# Altium project Schematic.PrjPcb
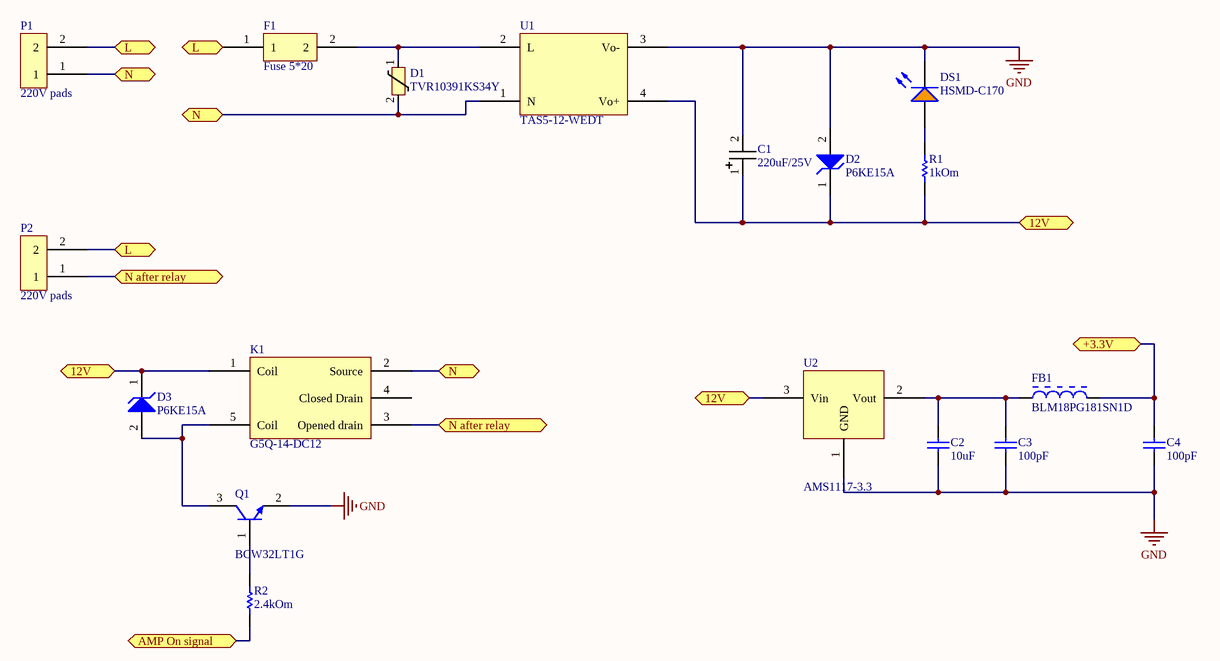
[diagram p0: power.SchDoc]
3 sheets, 62 parts. Net scope: flat (ports and power ports of the same name join across sheets).
Board file: PCB.PcbDoc
Sheets:
  power.SchDoc
  mcu.SchDoc
  ble.SchDoc

## Sheet power.SchDoc
size A4

### Parts
C1  220uF/25V  [Capacitor 7*8]
C2  10uF  [CAPC1608X90X35ML10T15]
C3  100pF  [CAPC1608X90X35ML10T15]
C4  100pF  [CAPC1608X90X35ML10T15]
D1  TVR10391KS34Y  [TVR10391KS34Y]
D2  P6KE15A  [ONSC-SURMETIC40-2-017AA-01]
D3  P6KE15A  [ONSC-SURMETIC40-2-017AA-01]
DS1  HSMD-C170  [AVAG-HSMX-C170_V]
F1  Fuse 5*20  [Fuse 5*20]
FB1  BLM18PG181SN1D  [MURA-BLM18PG_KG-CHIP-2_V2]
K1  G5Q-14-DC12  [G5Q-14-DC12]
P1  220V pads  [220V pads]
P2  220V pads  [220V pads]
Q1  BCW32LT1G  [ONSC-SOT-23-3-318-08_V]
R1  1kOm  [RESC1608X55X30ML20T10]
R2  2.4kOm  [RESC1608X55X30ML20T10]
U1  TAS5-12-WEDT  [TAS5-12-WEDT]
U2  AMS1117-3.3  [AMS1117]

### Ports
12V (bidir), +3.3V (bidir), AMP On signal (bidir), L (bidir), N (bidir), N after relay (bidir)

### Nets
GND: C1.2 C2.1 C3.1 C4.1 D2.2(A) DS1.2(K) Q1.2(E) U1.3(Vo-) U2.1(GND)
NetC1_1: C1.1 D2.1(K) D3.1(K) K1.1(Coil) R1.1 U1.4(Vo+) U2.3(Vin) ; port 12V
NetC2_2: C2.2 C3.2 FB1.1 U2.2(Vout)
NetC4_2: C4.2 FB1.2 ; port +3.3V
NetD1_1: D1.1 F1.2 U1.2(L)
NetD1_2: D1.2 K1.2(Source) P1.1 U1.1(N) ; port N
NetD3_2: D3.2(A) K1.5(Coil) Q1.3(C)
NetDS1_1: DS1.1(A) R1.2
NetF1_1: F1.1 P1.2 P2.2 ; port L
NetK1_3: K1.3(Opened_drain) P2.1 ; port N after relay
NetQ1_1: Q1.1(B) R2.2
NetR2_1: R2.1 ; port AMP On signal

Not connected (* = marked no-connect by the designer): K1 4(Closed_Drain)

### Library data of the parts
C1 = Capacitor 7*8
C2-C4 = CMP-2006-02335-1: Manufacturer: Murata; Part Number: GCM1885C2A101JA16D
D2 D3 = CMP-1061-00710-1: 600 W Peak Power Transient Voltage Suppressor, 2-Pin Surmetic(TM) 40, Pb-Free, Bulk Box; Manufacturer: On Semiconductor; PartNumber: P6KE15AG; PPK Max (W): 600; Direction: Unidirectional; V(BR) Typ (V): 15.05; IR Max (uA): 5; Packing: Bulk Box; ComponentLink2URL: http://www.onsemi.com/pub_link/Collateral/P6KE6.8A-D.PDF; ComponentLink1URL: http://www.onsemi.com/; DatasheetVersion: Rev. 10; ComponentLink2Description: Datasheet; ComponentLink3Description: Package Specification; Mounting Technology: Through Hole; PackageReference: SURMETIC40-2-017AA-01; ComponentLink1Description: Manufacturer URL; ComponentLink3URL: http://www.onsemi.cn/pub_link/Collateral/017AA.PDF; PackageVersion: Rev. O, 09/2005; RoHS: Pb-Free; PackageDescription: 2-Pin, Axial Lead, Diameter 3.49 mm
DS1 = CMP-2000-06421-1: LED Uni-Color Orange, 52 mW, 20 mA, -40 to 85 degC, 2-Pin SMD, RoHS, Tape and Reel; Manufacturer: Avago; Forward Current If Max: 20mA; External Length / Height: 2mm; Luminous Intensity: 8mcd; Lens Shape: Rectangular; Bulb Size: 1.25mmx1.4mm; External Width: 1.25mm; Wavelength Typ: 605nm; Dominant Wavelength: 604nm; PIV Max: 5V; Opto Mounting Orientation: Top; Viewing Angle: 170°; LED Type: Standard; Forward Voltage: 2.2V; SVHC: NoSVHC(19-Dec-2012); No. of Pins: 2; External Depth: 0.8mm; Power Dissipation Pd: 52mW; Storage Temperature Max: 85°C; Package Description: 2-Pin Surface Mount Device, Body 2 x 1.25 mm, Height 0.8 mm; MSL: MSL2A-4weeks; Operating Temperature Range: -30°Cto+85°C; Datasheet URL: http://docs.avagotech.com/docs/AV02-0551EN; Manufacturer URL: http://www.avagotech.com/; Operating Temperature Min: -30°C; Light Area Height: 1.25mm; Mounting Technology: SurfaceMount; Storage Temperature Min: -40°C; LED Mounting: SMD; Peak Wavelength: 605nm; Package / Case: SMD; Peak Forward Current: 20mA; Forward Voltage VF Max: 2.2V; Mounting Type: SMD; LED Colour: Orange; Forward Current If: 20mA; Operating Temperature Max: 85°C; Voltage Vf Typ: 2.2V; Package Reference: HSMX-C170; Datasheet Version: 03/2012; Opto Case Style: SMD; Luminous Intensity Typ: 8mcd
FB1 = CMP-0686-00566-2: Chip Ferrite Bead for Power Lines, 180 Ohm, 1500 mA, -55 to 125 degC, 1.6 x 0.8 x 0.95 mm SMD, Tape and Reel; Manufacturer: Murata; Impedance (at 100 MHz): 180 Ohm +/- 25%; Rated Current: 1500 mA; DC Resistance: 0.09 Ohm Max.; ComponentLink3Description: Package Specification; PackageDescription: 2-Pin Chip, Body 1.6 x 0.8 mm; Mounting Technology: Surface Mount; ComponentLink1Description: Manufacturer URL; Operating Temperature Range: -55 to 125 degC; Packing: Tape and Reel; DatasheetVersion: 08/2013; ComponentLink3URL: http://www.murata.com/products/catalog/pdf/c31e.pdf; ComponentLink2Description: Datasheet; PartNumber: BLM18PG181SN1D; ComponentLink1URL: http://www.murata.com/; ComponentLink2URL: http://www.murata.com/products/catalog/pdf/c31e.pdf; PackageReference: BLM18_H950-2
Q1 = CMP-1048-00823-1: General Purpose Transistor, NPN Silicon, 3-Pin SOT-23, Pb-Free, Tape and Reel; Manufacturer: On Semiconductor; IC Continuous (A): 0.1; PackageReference: SOT-23-3-318-08; Polarity: NPN; Mounting Technology: Surface Mount; ComponentLink2URL: http://www.onsemi.com/pub_link/Collateral/BCW32LT1-D.PDF; RoHS: TRUE; PackageVersion: Rev. AP, 11/2009; Packing: Tape and Reel; ComponentLink3Description: Package Specification; PartNumber: BCW32LT1G; ComponentLink1Description: Manufacturer URL; PackageDescription: 3-Pin Small Outline Transistor, Body 2.92 x 1.3 mm, Pitch 0.95 mm; ComponentLink3URL: http://www.onsemi.cn/pub_link/Collateral/318-08.PDF; ComponentLink1URL: http://www.onsemi.com/; DatasheetVersion: Rev. 2; ComponentLink2Description: Datasheet
R1 R2 = CMP-2000-01555-1: Part Number: RK73H1JTTD5101F; Manufacturer: KOA Speer
D1 = TVR10391KS34Y: ComponentLink1Description: https://lcsc.com/product-detail/Varistors_TKS-TVR10391KS34Y_C2760960.html; ComponentLink1URL: *
F1 = Fuse 5*20: ComponentLink1Description: https://lcsc.com/product-detail/span-style-background-color-ff0-Fuse-span-Holders_Xucheng-Elec-C3130_C3130.html; ComponentLink1URL: *
K1 = G5Q-14-DC12: ComponentLink1Description: https://lcsc.com/product-detail/Relays_Omron-Electronics-G5Q-14-DC12_C225715.html; ComponentLink1URL: *
U1 = TAS5-12-WEDT: ComponentLink1Description: https://lcsc.com/product-detail/Power-Modules_TDPOWER-TAS5-12-WEDT_C2687652.html; ComponentLink1URL: *
U2 = AMS1117-3.3: ComponentLink1Description: New link; ComponentLink1URL: https://lcsc.com/product-detail/Low-Dropout-Regulators-LDO_Slkor-SLKORMICRO-Elec-AMS1117-3-3_C426566.html; ComponentLink2Description: New link; ComponentLink2URL: https://lcsc.com/product-detail/Low-Dropout-Regulators-LDO_PUOLOP-AMS1117-3-3_C351784.html

## Sheet mcu.SchDoc
size A4
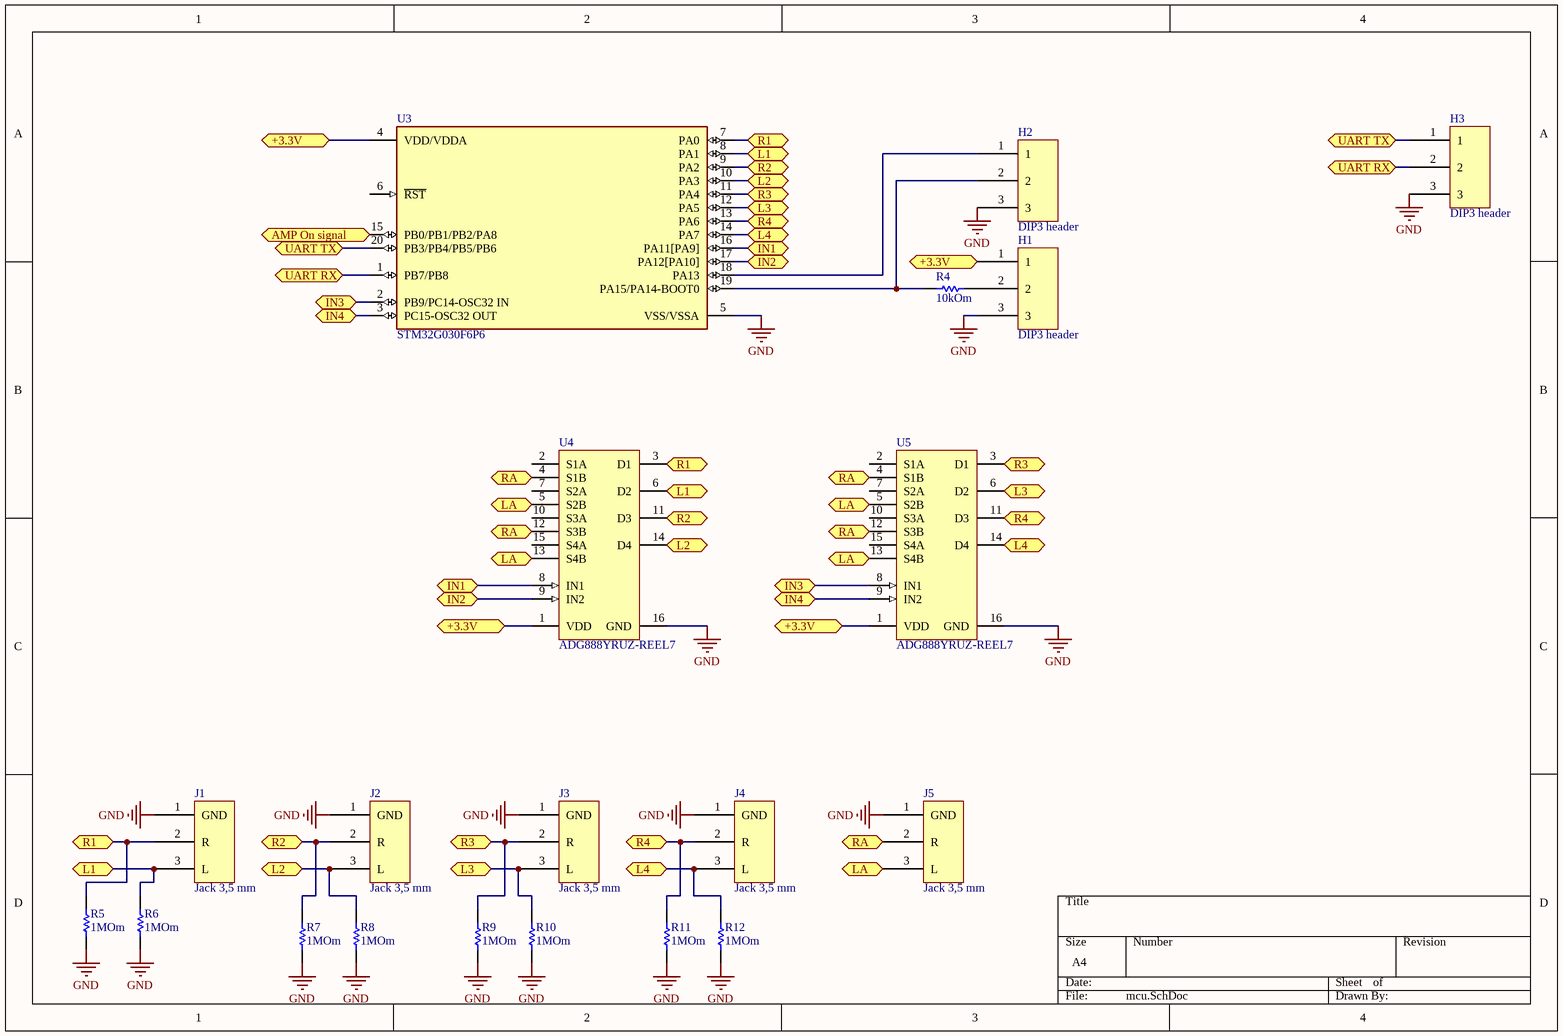
[diagram p1: mcu.SchDoc]

### Parts
H1  DIP3 header  [DIP3]
H2  DIP3 header  [DIP3]
H3  DIP3 header  [DIP3]
J1  Jack 3,5 mm  [jack 3,5mm]
J2  Jack 3,5 mm  [jack 3,5mm]
J3  Jack 3,5 mm  [jack 3,5mm]
J4  Jack 3,5 mm  [jack 3,5mm]
J5  Jack 3,5 mm  [jack 3,5mm]
R4  10kOm  [RESC1608X55X30ML20T10]
R5  1MOm  [RESC1608X55X30ML20T10]
R6  1MOm  [RESC1608X55X30ML20T10]
R7  1MOm  [RESC1608X55X30ML20T10]
R8  1MOm  [RESC1608X55X30ML20T10]
R9  1MOm  [RESC1608X55X30ML20T10]
R10  1MOm  [RESC1608X55X30ML20T10]
R11  1MOm  [RESC1608X55X30ML20T10]
R12  1MOm  [RESC1608X55X30ML20T10]
U3  STM32G030F6P6  [FP-TSSOP20-YA-MFG]
U4  ADG888YRUZ-REEL7  [ADI-RU-16_N]
U5  ADG888YRUZ-REEL7  [ADI-RU-16_N]

### Ports
+3.3V (bidir), AMP On signal (bidir), IN1 (bidir), IN2 (bidir), IN3 (bidir), IN4 (bidir), L1 (bidir), L2 (bidir), L3 (bidir), L4 (bidir), LA (bidir), R1 (bidir), R2 (bidir), R3 (bidir), R4 (bidir), RA (bidir), UART RX (bidir), UART TX (bidir)

### Nets
GND: H1.3 H2.3 H3.3 J1.1(GND) J2.1(GND) J3.1(GND) J4.1(GND) J5.1(GND) R5.1 R6.1 R7.1 R8.1 R9.1 R10.1 R11.1 R12.1 U3.5(VSS/VSSA) U4.16(GND) U5.16(GND)
NetC4_2: H1.1 U3.4(VDD/VDDA) U4.1(VDD) U5.1(VDD) ; port +3.3V
NetH1_2: H1.2 R4.2
NetH2_1: H2.1 U3.18(PA13)
NetH2_2: H2.2 R4.1 U3.19(PA15/PA14-BOOT0)
NetH3_1: H3.1 U3.20(PB3/PB4/PB5/PB6) ; port UART TX
NetH3_2: H3.2 U3.1(PB7/PB8) ; port UART RX
NetJ1_2: J1.2(R) R5.2 U3.7(PA0) U4.3(D1) ; port R1
NetJ1_3: J1.3(L) R6.2 U3.8(PA1) U4.6(D2) ; port L1
NetJ2_2: J2.2(R) R7.2 U3.9(PA2) U4.11(D3) ; port R2
NetJ2_3: J2.3(L) R8.2 U3.10(PA3) U4.14(D4) ; port L2
NetJ3_2: J3.2(R) R9.2 U3.11(PA4) U5.3(D1) ; port R3
NetJ3_3: J3.3(L) R10.2 U3.12(PA5) U5.6(D2) ; port L3
NetJ4_2: J4.2(R) R11.2 U3.13(PA6) U5.11(D3) ; port R4
NetJ4_3: J4.3(L) R12.2 U3.14(PA7) U5.14(D4) ; port L4
NetJ5_2: J5.2(R) U4.4(S1B) U4.12(S3B) U5.4(S1B) U5.12(S3B) ; port RA
NetJ5_3: J5.3(L) U4.5(S2B) U4.13(S4B) U5.5(S2B) U5.13(S4B) ; port LA
NetR2_1: U3.15(PB0/PB1/PB2/PA8) ; port AMP On signal
NetU3_2: U3.2(PB9/PC14-OSC32_IN) U5.8(IN1) ; port IN3
NetU3_3: U3.3(PC15-OSC32_OUT) U5.9(IN2) ; port IN4
NetU3_16: U3.16(PA11[PA9]) U4.8(IN1) ; port IN1
NetU3_17: U3.17(PA12[PA10]) U4.9(IN2) ; port IN2

Not connected (* = marked no-connect by the designer): U3 6(~{RST}); U4 2(S1A) 7(S2A) 10(S3A) 15(S4A); U5 2(S1A) 7(S2A) 10(S3A) 15(S4A)

### Library data of the parts
R4-R12 = CMP-2000-01555-1: as R1 on sheet power
U3 = CMP-12105-000034-1: ARM MICROCONTROLLERS - MCU; Manufacturer: STMicroelectronics; Max Supply Voltage: 3.6V; Interface: I2C,SPI,USART,LIN,IrDA,I2S,SMBus; Memory Size: 32KBytes; Number Of I/Os: 17; Number Of Timers/Counters: 6; Core Architecture: ARM Cortex-M0+; Number Of Pwm Channels: 11; Standoff Height: 0.05mm; Number Of A/D Converters: 1; Number Of I2C Channels: 2; Data Bus Width: 32bits; Ram Size: 8KBytes; Max Junction Temp: +105°C; Number Of Spi Channels: 3; Min Supply Voltage: 2V; Number Of Adc Channels: 16; Memory Type: FLASH; Frequency: 64MHz; Ambient Temperature Range Low: -40°C; ComponentLink2URL: https://www.st.com/resource/en/datasheet/stm32g030f6.pdf; Temperature Range Low: -40°C; Automotive: No; Device Class L1: Integrated Circuits (ICs); Category: IC; Temperature Range High: +85°C; ComponentLink2Description: Datasheet; Device Class L2: Embedded Processors and Controllers; Manufacturer Part Number: STM32G030F6P6; Height: 1.2mm; Ambient Temperature Range High: +85°C; Octopart: https://octopart.com/stm32g030f6p6-stmicroelectronics-103773023; Package: TSSOP20-YA; Temperature: -40°C to +85°C; Lead Free: Yes; Device Class L3: Microcontrollers; Number Of Uart Channels: 2; RoHS: TRUE; Number Of Cores: 1; Digikey Description: ARM MICROCONTROLLERS - MCU
U4 U5 = CMP-0790-00216-1: 0.4 Ohm CMOS, Dual DPDT Switches, -40 to 125 degC, 16-pin SOP (RU-16), Reel; Manufacturer: Analog Devices; Id, Is (ON): 200pA, 200pA, 200pA; Ron (ohms): 0.4; # Sw Functions: 2; Configuration: SPDT; Power Dissipation: 20uW; Max Pos Supply: 5.5V; Min Pos Supply: 1.8V; ComponentLink3URL: http:/www.analog.com/static/imported-files/packages/36244347913743854010197452789RU16.pdf; ComponentLink1URL: http://www.analog.com/en/index.html; Mounting Technology: Surface Mount; Is OFF: 200pA, 200pA, 200pA; PackageReference: RU-16; PartNumber: ADG888YRUZ-REEL7; ComponentLink1Description: Manufacturer URL; ComponentLink3Description: Package Specification; ComponentLink2Description: Datasheet; ComponentLink2URL: http://www.analog.com/static/imported-files/data_sheets/ADG888.pdf; Packing: Reel; PackageVersion: Nov-02; DatasheetVersion: Rev. A; Code_JEDEC: MO-153AB; PackageDescription: 16-Pin Thin Shrink Small Outline Package, Body 5 x 4.4 mm, Pitch 0.65 mm
J1-J5 = Jack 3,5 mm: ComponentLink1Description: https://lcsc.com/product-detail/Audio-Video-Connectors_BOOMELE-Boom-Precision-Elec-PJ-307C_C16684.html; ComponentLink1URL: *

## Sheet ble.SchDoc
size A4
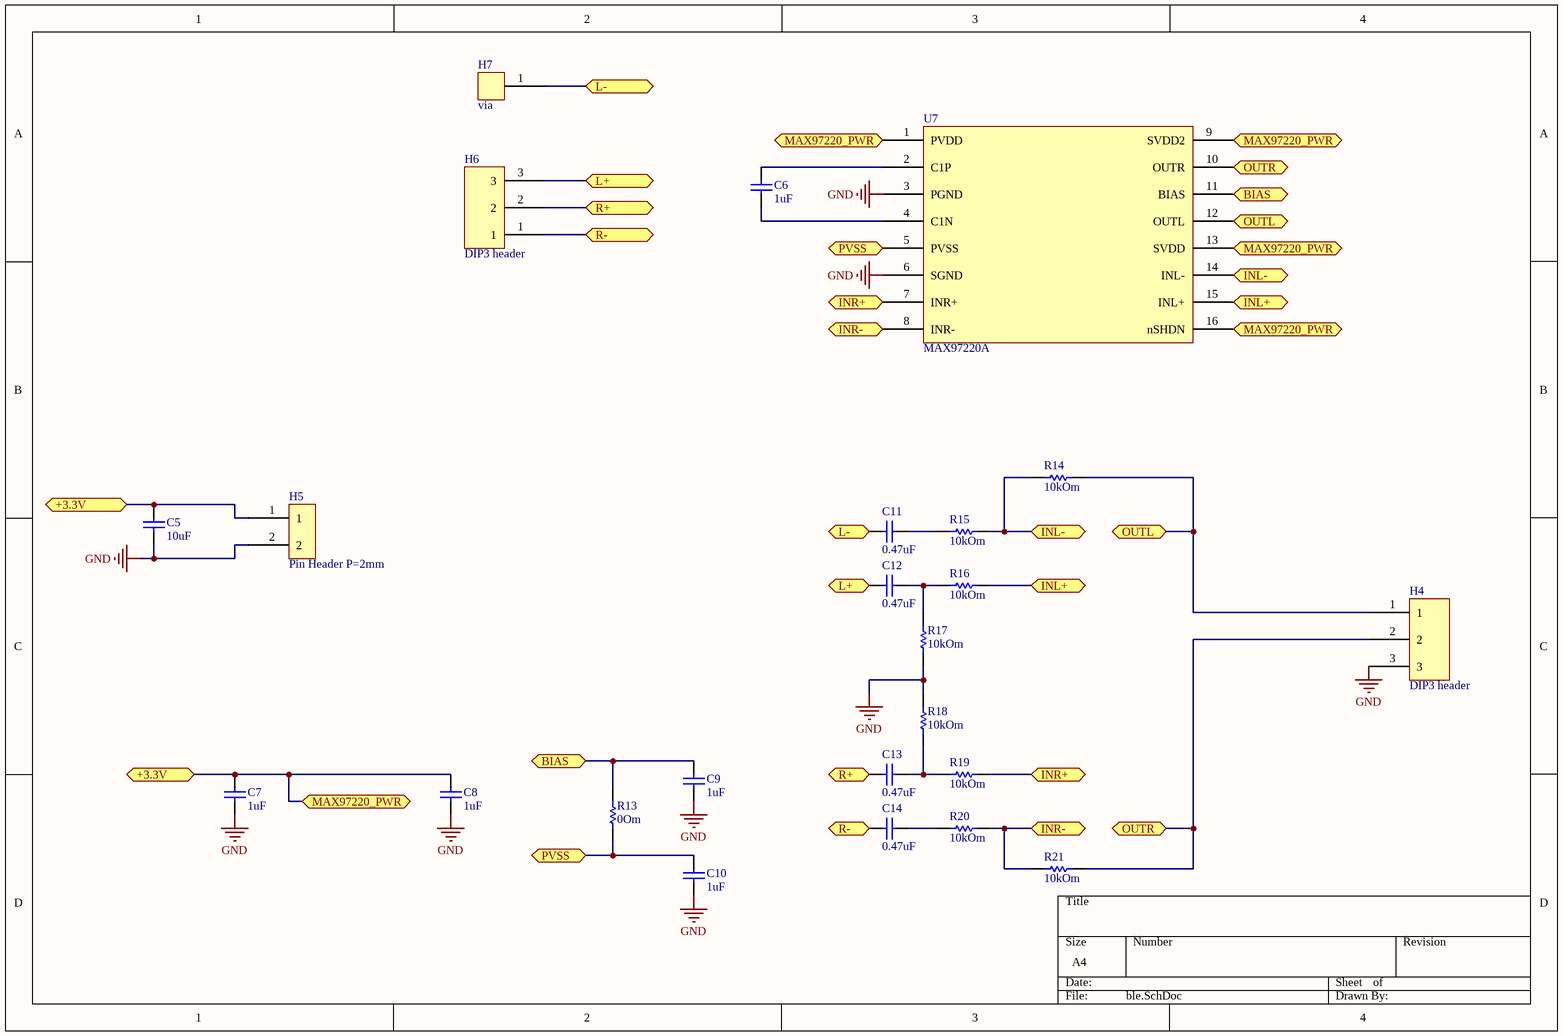
[diagram p2: ble.SchDoc]

### Parts
C5  10uF  [CAPC1608X90X35ML10T15]
C6  1uF  [CAPC1608X90X35ML10T15]
C7  1uF  [CAPC1608X90X35ML10T15]
C8  1uF  [CAPC1608X90X35ML10T15]
C9  1uF  [CAPC1608X90X35ML10T15]
C10  1uF  [CAPC1608X90X35ML10T15]
C11  0.47uF  [CAPC1608X90X35ML10T15]
C12  0.47uF  [CAPC1608X90X35ML10T15]
C13  0.47uF  [CAPC1608X90X35ML10T15]
C14  0.47uF  [CAPC1608X90X35ML10T15]
H4  DIP3 header  [DIP3]
H5  Pin Header P=2mm  [Pin Header P=2mm]
H6  DIP3 header  [DIP3]
H7  via  [via]
R13  0Om  [RESC1608X55X30ML20T10]
R14  10kOm  [RESC1608X55X30ML20T10]
R15  10kOm  [RESC1608X55X30ML20T10]
R16  10kOm  [RESC1608X55X30ML20T10]
R17  10kOm  [RESC1608X55X30ML20T10]
R18  10kOm  [RESC1608X55X30ML20T10]
R19  10kOm  [RESC1608X55X30ML20T10]
R20  10kOm  [RESC1608X55X30ML20T10]
R21  10kOm  [RESC1608X55X30ML20T10]
U7  MAX97220A  [MAX97220A]

### Ports
+3.3V (bidir), BIAS (bidir), INL+ (bidir), INL- (bidir), INR+ (bidir), INR- (bidir), L+ (bidir), L- (bidir), MAX97220_PWR (bidir), OUTL (bidir), OUTR (bidir), PVSS (bidir), R+ (bidir), R- (bidir)

### Nets
GND: C5.1 C7.1 C8.1 C9.1 C10.1 H4.3 H5.2 R17.1 R18.2 U7.3(PGND) U7.6(SGND)
NetC4_2: C5.2 C7.2 C8.2 H5.1 U7.1(PVDD) U7.9(SVDD2) U7.13(SVDD) U7.16(nSHDN) ; port +3.3V, port MAX97220_PWR
NetC6_1: C6.1 U7.4(C1N)
NetC6_2: C6.2 U7.2(C1P)
NetC9_2: C9.2 R13.2 U7.11(BIAS) ; port BIAS
NetC10_2: C10.2 R13.1 U7.5(PVSS) ; port PVSS
NetC11_1: C11.1 H7.1 ; port L-
NetC11_2: C11.2 R15.1
NetC12_1: C12.1 H6.3 ; port L+
NetC12_2: C12.2 R16.1 R17.2
NetC13_1: C13.1 H6.2 ; port R+
NetC13_2: C13.2 R18.1 R19.1
NetC14_1: C14.1 H6.1 ; port R-
NetC14_2: C14.2 R20.1
NetH4_1: H4.1 R14.2 U7.12(OUTL) ; port OUTL
NetH4_2: H4.2 R21.2 U7.10(OUTR) ; port OUTR
NetR14_1: R14.1 R15.2 U7.14(INL-) ; port INL-
NetR16_2: R16.2 U7.15(INL+) ; port INL+
NetR19_2: R19.2 U7.7(INR+) ; port INR+
NetR20_2: R20.2 R21.1 U7.8(INR-) ; port INR-

### Library data of the parts
C5-C14 = CMP-2006-02335-1: as C2 on sheet power
R13-R21 = CMP-2000-01555-1: as R1 on sheet power

## Nets that join several sheets
GND: power (9 pins), mcu (19 pins), ble (11 pins)
NetC4_2: power (C4.2 FB1.2), mcu (H1.1 U3.4 U4.1 U5.1), ble (8 pins)
NetR2_1: power (R2.1), mcu (U3.15)